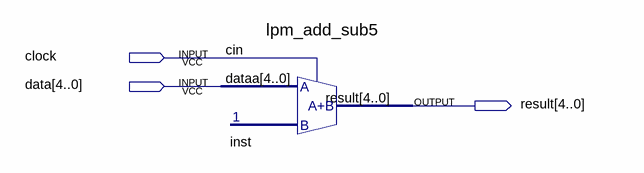
[diagram p0: schematic sheet]
// Quartus schematic PC.bdf as structural Verilog: 1 symbols, 3 pins
module PC (
  input  clock,
  input  [4:0] data,
  output [4:0] result
);

  lpm_add_sub5 inst (.dataa(data), .cin(clock), .result(result));
endmodule
